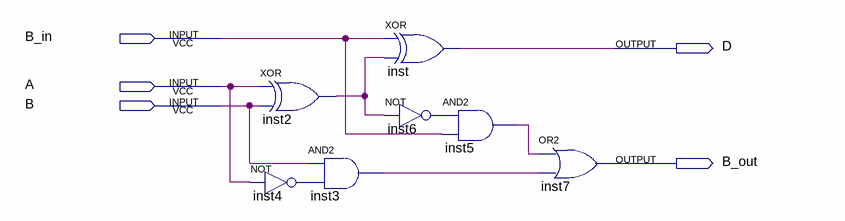
[diagram p0: schematic sheet]
// Quartus schematic subtrator.bdf as structural Verilog: 7 symbols, 5 pins
module subtrator (
  input  B_in,
  input  A,
  input  B,
  output D,
  output B_out
);

  wire inst2_out, inst3_out, inst4_out, inst5_out, inst6_out;

  xor inst2 (inst2_out, A, B);
  not inst4 (inst4_out, A);
  and inst3 (inst3_out, B, inst4_out);
  xor inst (D, B_in, inst2_out);
  and inst5 (inst5_out, inst6_out, B_in);
  not inst6 (inst6_out, inst2_out);
  or inst7 (B_out, inst5_out, inst3_out);
endmodule
